# EAGLE board untitled (EAGLE 6.4), part 1 of 2
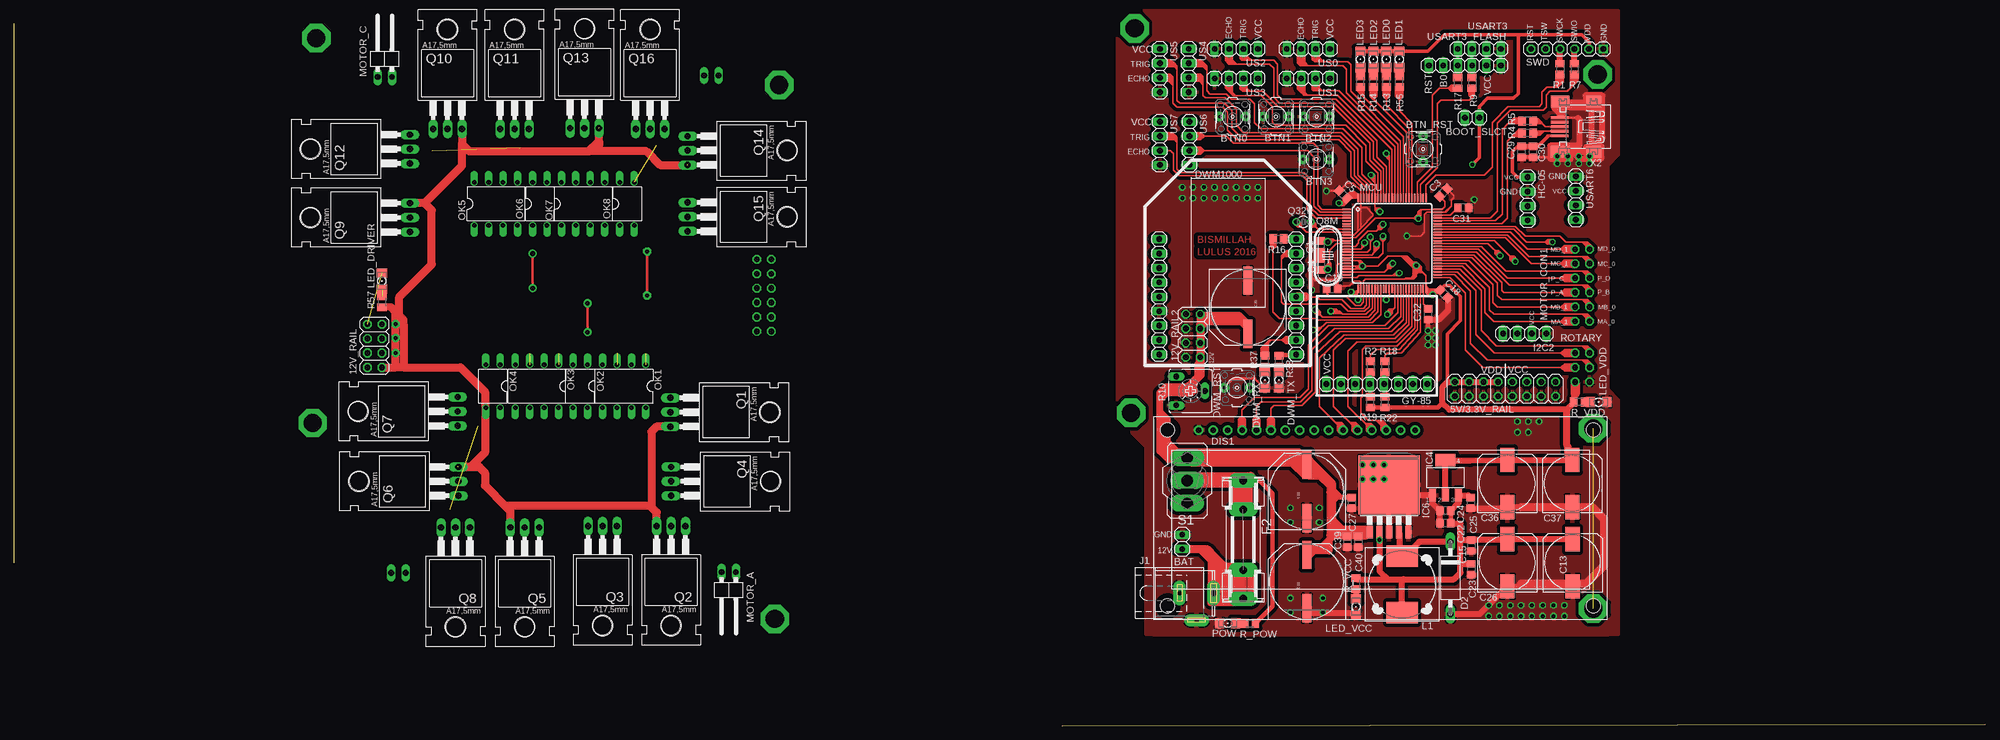
[diagram p5: board, top side]
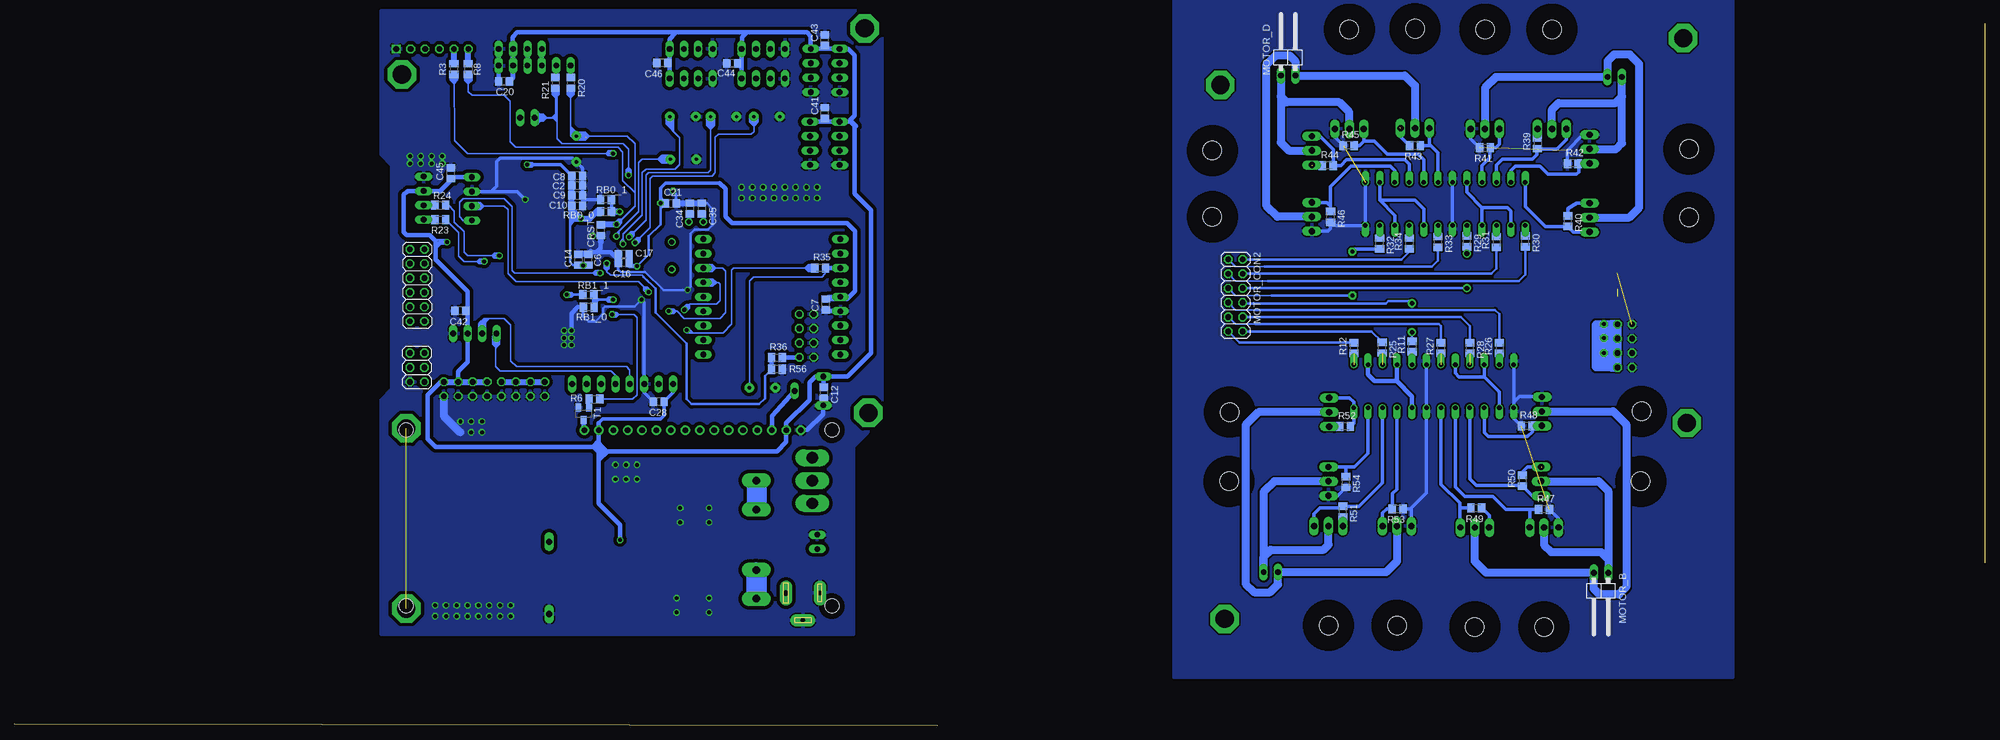
[diagram p6: board, bottom side, seen from below]

Size 347.2 x 123.7 mm. Coordinates in mm from the lower left corner, seen from the top.
Outline: 184.53,0 347.2,0.25
Outline: 0,28.7 0,123.7
Copper layers (1*16): Top 0.035mm / dielectric 1.5mm / Bottom 0.035mm
Design rules "default": minimum track width 10mil, minimum drill 24mil, track to track 8mil, track to pad 8mil, pad to pad 8mil, via to via 8mil, smd to smd 8mil, copper to edge 40mil, drill to drill 8mil, minimum pad ring 10mil, minimum via ring 8mil, stop-mask expansion 4mil, vias tented up to drill 0mil, thermal gap 10mil

## Footprints (pad centres in the part's own frame; a part is rotated, then mirrored left to right if it is on the bottom)
2X08 = drill 1.016 octagon: 1 -8.89,-1.27; 2 -8.89,1.27; 3 -6.35,-1.27; 4 -6.35,1.27; 5 -3.81,-1.27; 6 -3.81,1.27; 7 -1.27,-1.27; 8 -1.27,1.27; 9 1.27,-1.27; 10 1.27,1.27; 11 3.81,-1.27; 12 3.81,1.27; 13 6.35,-1.27; 14 6.35,1.27; 15 8.89,-1.27; 16 8.89,1.27
2X04 = drill 1.016 octagon: 1 -3.81,-1.27; 2 -3.81,1.27; 3 -1.27,-1.27; 4 -1.27,1.27; 5 1.27,-1.27; 6 1.27,1.27; 7 3.81,-1.27; 8 3.81,1.27
1X02 = drill 1.016 long: 1 -1.27,0; 2 1.27,0
PUSHBUTTON = drill 0.6 pad 1.676: 1 0,2.286; 2 0,-2.286
C0805 = smd 1.3 x 1.5: 1 -0.95,0; 2 0.95,0
PANASONIC_H13 = smd 5 x 1.6: + 4.7,0; - -4.7,0
153CLV-1012 = smd 4.3 x 2.5: + 4.15,0; - -4.15,0
DO15-12 = drill 1.118 long: A 6.35,0; C -6.35,0
TUXGR_16X2_R2 = drill 1 pad 1.676: 1 -32,15.5; 2 -29.46,15.5; 3 -26.92,15.5; 4 -24.38,15.5; 5 -21.84,15.5; 6 -19.3,15.5; 7 -16.76,15.5; 8 -14.22,15.5; 9 -11.68,15.5; 10 -9.14,15.5; 11 -6.6,15.5; 12 -4.06,15.5; 13 -1.52,15.5; 14 1.02,15.5; 15 3.56,15.5; 16 6.1,15.5 | hole 2.5: -37.5,-15.5; 37.5,-15.5; -37.5,15.5; 37.5,15.5
1206 = smd 1.6 x 1.803: A -1.422,0; C 1.422,0
SHK20L = drill 1.321 pad 2.54 long: 1A -10.414,0; 1B -5.334,0; 2A 10.414,0; 2B 5.334,0
1X08 = drill 1.016 long: 1 -8.89,0; 2 -6.35,0; 3 -3.81,0; 4 -1.27,0; 5 1.27,0; 6 3.81,0; 7 6.35,0; 8 8.89,0
1X04 = drill 1.016 long: 1 -3.81,0; 2 -1.27,0; 3 1.27,0; 4 3.81,0
SOT223 = smd 1.219 x 2.235: 1 -2.311,-3.099; 2 0,-3.099; 3 2.311,-3.099 | smd 3.6 x 2.2: 4 0,3.099
TO263-5 = smd 1.067 x 2.159: 1 -3.404,-5.791; 2 -1.702,-5.791; 3 0,-5.791; 4 1.702,-5.791; 5 3.404,-5.791 | smd 10.8 x 10.41: 6 0,2.54
SPC4078 = drill 0.8 pad 2.184 long: 1 -3,0; 2 0,-4.8 | drill 1 pad 2.184 long: 3 3,0
DR127 = smd 3.85 x 5.5: 1 -4.975,0; 2 4.975,0
LQFP100 = smd 1.5 x 0.26: 1 -8,6; 2 -8,5.5; 3 -8,5; 4 -8,4.5; 5 -8,4; 6 -8,3.5; 7 -8,3; 8 -8,2.5; 9 -8,2; 10 -8,1.5; 11 -8,1; 12 -8,0.5; 13 -8,0; 14 -8,-0.5; 15 -8,-1; 16 -8,-1.5; 17 -8,-2; 18 -8,-2.5; 19 -8,-3; 20 -8,-3.5; 21 -8,-4; 22 -8,-4.5; 23 -8,-5; 24 -8,-5.5; 25 -8,-6; 51 8,-6; 52 8,-5.5; 53 8,-5; 54 8,-4.5; 55 8,-4; 56 8,-3.5; 57 8,-3; 58 8,-2.5; 59 8,-2; 60 8,-1.5; 61 8,-1; 62 8,-0.5; 63 8,0; 64 8,0.5; 65 8,1; 66 8,1.5; 67 8,2; 68 8,2.5; 69 8,3; 70 8,3.5; 71 8,4; 72 8,4.5; 73 8,5; 74 8,5.5; 75 8,6 | smd 0.26 x 1.5: 26 -6,-8; 27 -5.5,-8; 28 -5,-8; 29 -4.5,-8; 30 -4,-8; 31 -3.5,-8; 32 -3,-8; 33 -2.5,-8; 34 -2,-8; 35 -1.5,-8; 36 -1,-8; 37 -0.5,-8; 38 0,-8; 39 0.5,-8; 40 1,-8; 41 1.5,-8; 42 2,-8; 43 2.5,-8; 44 3,-8; 45 3.5,-8; 46 4,-8; 47 4.5,-8; 48 5,-8; 49 5.5,-8; 50 6,-8; 76 6,8; 77 5.5,8; 78 5,8; 79 4.5,8; 80 4,8; 81 3.5,8; 82 3,8; 83 2.5,8; 84 2,8; 85 1.5,8; 86 1,8; 87 0.5,8; 88 0,8; 89 -0.5,8; 90 -1,8; 91 -1.5,8; 92 -2,8; 93 -2.5,8; 94 -3,8; 95 -3.5,8; 96 -4,8; 97 -4.5,8; 98 -5,8; 99 -5.5,8; 100 -6,8
1X02/90 = drill 1.016 long: 1 -1.27,-3.81; 2 1.27,-3.81
2X06 = drill 1.016 octagon: 1 -6.35,-1.27; 2 -6.35,1.27; 3 -3.81,-1.27; 4 -3.81,1.27; 5 -1.27,-1.27; 6 -1.27,1.27; 7 1.27,-1.27; 8 1.27,1.27; 9 3.81,-1.27; 10 3.81,1.27; 11 6.35,-1.27; 12 6.35,1.27
DIL08 = drill 0.813 offset: 1 -3.81,-3.81; 2 -1.27,-3.81; 3 1.27,-3.81; 4 3.81,-3.81; 5 3.81,3.81; 6 1.27,3.81; 7 -1.27,3.81; 8 -3.81,3.81
DIL04 = drill 0.813 offset: 1 -1.27,-3.81; 2 1.27,-3.81; 3 1.27,3.81; 4 -1.27,3.81
TO220 = drill 1.118 long: 1 -2.54,-6.35; 2 0,-6.35; 3 2.54,-6.35 | hole 3.302: 0,11.176
HC49U-V = drill 0.813: 1 -2.413,0; 2 2.413,0
TC26V = drill 0.813: 1 -1.27,0; 2 1.27,0
M0805 = smd 1.3 x 1.6: 1 -0.95,0; 2 0.95,0
CA6V = drill 1.016 long: A -2.54,-2.54; E 2.54,-2.54; S 0,2.54
R0805 = smd 1.3 x 1.5: 1 -0.95,0; 2 0.95,0
2X03 = drill 1.016 octagon: 1 -2.54,-1.27; 2 -2.54,1.27; 3 0,-1.27; 4 0,1.27; 5 2.54,-1.27; 6 2.54,1.27
320-916 = drill 2.007 long: 1 0,4.013; 2 0,0; 3 0,-4.013
1X06-S = drill 1.016 square: 1 -6.35,0 | drill 1.016 octagon: 2 -3.81,0; 3 -1.27,0; 4 1.27,0; 5 3.81,0; 6 6.35,0
SOT23-BEC = smd 1 x 1.4: B -0.95,-1.1; C 0,1.1; E 0.95,-1.1
MY_DWM1000_PAD_ONLY = drill 1.016 long: 1 -0.635,-12.065; 2 1.905,-12.065; 3 4.445,-12.065; 4 6.985,-12.065; 5 9.525,-12.065; 6 12.065,-12.065; 7 14.605,-12.065; 8 17.145,-12.065; 9 19.685,-12.065; 10 19.685,12.065; 11 17.145,12.065; 12 14.605,12.065; 13 12.065,12.065; 14 9.525,12.065; 15 6.985,12.065; 16 4.445,12.065; 17 1.905,12.065; 18 -0.635,12.065
1X06 = drill 1.016 long: 1 -6.35,0; 2 -3.81,0; 3 -1.27,0; 4 1.27,0; 5 3.81,0; 6 6.35,0
32005-400 = smd 3.1 x 0.5: 1 3,1.6; 2 3,0.8; 3 3,0; 4 3,-0.8; 5 3,-1.6 | smd 2.5 x 2: M1 -3,-4.45; M2 -3,4.45 | smd 3.3 x 2: M3 2.9,4.45; M4 2.9,-4.45

## Placement (x,y rotation side)
5V/3.3V_RAIL  [2X08]  262.64,59.31 180 top
12V_RAIL  [2X04]  63.5,66.93 90 top
12V_RAIL2  [2X04]  207.64,68.71 90 top
BAT  [1X02]  205.74,32.38 270 top
BOOT_SLCT  [1X02]  256.79,107.12 0 top
BTN0  PUSHBTN  [PUSHBUTTON]  214.63,107.31 270 top
BTN1  PUSHBTN  [PUSHBUTTON]  222.25,107.31 270 top
BTN2  PUSHBTN  [PUSHBUTTON]  229.43,107.31 270 top
BTN3  PUSHBTN  [PUSHBUTTON]  229.36,99.82 270 top
BTN_RST  PUSHBTN  [PUSHBUTTON]  248.16,101.6 0 top
C1  [C0805]  230.12,84.45 90 top
C2  [C0805]  248.03,95.19 0 bottom
C3  [C0805]  251.75,93.94 45 top
C4  [C0805]  230.12,81.28 270 top
C5  [C0805]  234.06,93.6 315 top
C6  [C0805]  247.84,82.11 270 bottom
C7  [C0805]  204.22,74.23 90 bottom
C8  [C0805]  248.03,96.9 180 bottom
C9  [C0805]  248.03,93.47 0 bottom
C10  [C0805]  248.03,91.63 0 bottom
C11  [PANASONIC_H13]  227.71,25.4 90 top
C12  [C0805]  204.6,58.67 270 bottom
C13  [153CLV-1012]  274.51,28.7 90 top
C14  [C0805]  246.06,82.11 90 bottom
C15  [C0805]  256.67,31.75 270 top
C16  [C0805]  239.84,81.53 180 bottom
C17  [C0805]  239.84,83.06 180 bottom
C18  [C0805]  251.83,76.11 315 top
C19  [C0805]  232.14,76.99 0 top
C20  10u  [C0805]  260.92,113.54 180 bottom
C21  [C0805]  231.52,92.08 0 bottom
C22  [C0805]  252.09,35.69 180 top
C23  [C0805]  256.67,27.56 270 top
C24  [C0805]  252.09,37.85 180 top
C25  [C0805]  256.54,39.24 270 top
C26  100u  [153CLV-1012]  263.02,28.7 90 top
C27  [C0805]  235.59,39.24 270 top
C28  [C0805]  233.68,57.09 180 bottom
C29  [C0805]  265.56,101.09 90 top
C30  [C0805]  267.59,101.09 90 top
C31  [C0805]  255.25,91.25 180 top
C32  [C0805]  249.05,72.52 90 top
C33  [PANASONIC_H13]  227.71,41.28 90 top
C34  [C0805]  228.22,91.12 270 bottom
C35  [C0805]  226.06,91.12 270 bottom
C36  100u  [153CLV-1012]  263.02,42.67 90 top
C37  100u  [153CLV-1012]  274.45,42.67 90 top
C38  [PANASONIC_H13]  217.3,73.72 270 top
C39  [C0805]  234.82,32.38 270 top
C40  [C0805]  236.73,32.38 270 top
C41  [C0805]  204.41,107.95 90 bottom
C42  [C0805]  268.61,73.09 180 bottom
C43  [C0805]  204.41,120.78 90 bottom
C44  [C0805]  220.73,116.65 180 bottom
C45  [C0805]  270.32,97.35 90 bottom
C46  [C0805]  233.04,116.78 180 bottom
CRST  [C0805]  243.9,87.31 90 bottom
D2  1N5822  [DO15-12]  252.98,26.04 270 top
DIS1  TUXGR_16X2_R2  [TUXGR_16X2_R2]  240.66,36.58 0 top
DWM_RST  PUSHBTN  [PUSHBUTTON]  215.39,59.56 270 top
DWM_RX  [1206]  220.28,60.9 270 top
DWM_TX  [1206]  222.76,60.9 270 top
F2  [SHK20L]  216.47,32.77 270 top
GY-85  [1X08]  240.03,60.2 0 top
HC-05  [1X04]  266.57,92.84 270 top
I2C2  [1X04]  266.06,69.09 180 top
IC4  LD1117 3.3V  [SOT223]  252.09,43.69 0 top
IC6  LM2576  [TO263-5]  242.19,39.88 0 top
J1  [SPC4078]  208.28,23.37 0 top
L1  100mH  [DR127]  244.47,24.89 270 top
LED0  [1206]  243.97,117.41 270 top
LED1  [1206]  241.68,117.41 270 top
LED2  [1206]  239.39,117.41 270 top
LED3  [1206]  237.11,117.41 270 top
LED_DRIVER  [1206]  64.77,78.36 90 top
LED_VCC  [1206]  236.35,20.96 270 top
LED_VDD  [1206]  279.08,57.02 0 top
MCU  STM32F407VX  [LQFP100]  242.7,84.96 0 top
MOTOR_A  [1X02/90]  125.86,23.24 180 top
MOTOR_B  [1X02/90]  67.69,23.11 180 bottom
MOTOR_C  [1X02/90]  65.28,118.11 0 top
MOTOR_CON1  [2X06]  276.23,77.6 270 bottom
MOTOR_CON2  [2X06]  132.08,75.82 270 bottom
MOTOR_D  [1X02/90]  122.81,118.37 0 bottom
OK1  PC827  [DIL08]  107.44,59.82 180 top
OK2  PC817  [DIL04]  99.69,59.82 180 top
OK3  PC827  [DIL08]  92.08,59.82 180 top
OK4  PC817  [DIL04]  84.33,59.82 180 top
OK5  PC827  [DIL08]  84.84,91.95 0 top
OK6  PC817  [DIL04]  92.58,91.95 0 top
OK7  PC827  [DIL08]  100.2,91.95 0 top
OK8  PC817  [DIL04]  107.95,91.95 0 top
POW  [1206]  213.74,18.03 180 top
Q1  IRF9530  [TO220]  121.92,55.25 270 top
Q2  IRF9530  [TO220]  115.7,28.83 180 top
Q3  IRF540  [TO220]  103.63,28.83 180 top
Q4  IRF540  [TO220]  122.05,43.05 270 top
Q5  IRF9530  [TO220]  89.92,28.58 180 top
Q6  IRF9530  [TO220]  71.88,43.05 90 top
Q7  IRF540  [TO220]  71.75,55.37 90 top
Q8  IRF540  [TO220]  77.72,28.58 180 top
Q8M  [HC49U-V]  231.39,82.8 270 top
Q9  IRF9530  [TO220]  63.37,89.53 90 top
Q10  IRF9530  [TO220]  76.33,111.51 0 top
Q11  IRF540  [TO220]  88.14,111.51 0 top
Q12  IRF540  [TO220]  63.37,101.61 90 top
Q13  IRF9530  [TO220]  100.46,111.64 0 top
Q14  IRF9530  [TO220]  124.97,101.35 270 top
Q15  IRF540  [TO220]  124.97,89.66 270 top
Q16  IRF540  [TO220]  112.01,111.51 0 top
Q32K  [TC26V]  227.08,88.77 180 top
R1  [M0805]  272.29,115.7 90 top
R2  [M0805]  238.89,63.25 90 top
R3  [M0805]  269.75,115.7 90 bottom
R4  [M0805]  266.57,104.39 0 top
R5  [M0805]  266.57,106.55 0 top
R6  [M0805]  244.98,57.53 180 bottom
R7  [M0805]  274.83,115.7 90 top
R8  [M0805]  267.21,115.7 90 bottom
R9  [M0805]  256.79,113.28 90 top
R10  [CA6V]  207.2,58.99 270 top
R11  [M0805]  100.97,66.8 90 bottom
R12  [M0805]  111.25,66.55 90 bottom
R13  [M0805]  241.68,113.47 270 top
R14  [M0805]  239.39,113.47 270 top
R15  [M0805]  237.11,113.47 270 top
R16  [M0805]  222.69,85.79 180 top
R17  [M0805]  254.25,113.28 90 top
R18  [M0805]  241.43,63.25 90 top
R19  [M0805]  238.89,57.02 270 top
R20  [R0805]  249.17,113.28 270 bottom
R21  [R0805]  251.84,113.28 270 bottom
R22  [M0805]  241.43,57.02 270 top
R23  [M0805]  272.16,89.15 180 bottom
R24  [M0805]  272.16,91.69 180 bottom
R25  [M0805]  106.24,66.61 270 bottom
R26  [M0805]  85.6,66.55 90 bottom
R27  [M0805]  95.88,66.55 90 bottom
R28  [M0805]  90.8,66.55 270 bottom
R29  [M0805]  91.31,85.35 270 bottom
R30  [M0805]  81.03,85.35 270 bottom
R31  [M0805]  86.11,85.22 90 bottom
R32  [M0805]  106.68,84.97 270 bottom
R33  [M0805]  96.39,85.22 270 bottom
R34  [M0805]  101.47,84.97 90 bottom
R35  [M0805]  205.23,80.64 0 bottom
R36  [M0805]  212.85,62.8 0 bottom
R37  [M0805]  220.28,64.2 270 top
R38  [M0805]  222.76,64.2 270 top
R39  [M0805]  78.87,102.62 90 bottom
R40  [M0805]  73.53,88.91 270 bottom
R41  [M0805]  88.14,101.86 180 bottom
R42  [M0805]  72.64,99.06 0 bottom
R43  [M0805]  100.46,102.24 180 bottom
R44  [M0805]  115.82,98.68 0 bottom
R45  [M0805]  112.14,102.24 0 bottom
R46  [M0805]  115.32,89.66 270 bottom
R47  [M0805]  77.72,38.1 0 bottom
R48  [M0805]  80.77,52.83 0 bottom
R49  [M0805]  89.66,38.35 180 bottom
R50  [M0805]  81.53,43.18 90 bottom
R51  [M0805]  113.16,37.72 270 bottom
R52  [M0805]  112.78,52.7 0 bottom
R53  [M0805]  103.5,38.23 180 bottom
R54  [M0805]  112.65,42.93 270 bottom
R55  [M0805]  243.97,113.47 270 top
R56  [M0805]  212.85,64.9 180 bottom
R57  [M0805]  64.77,74.68 90 top
R_POW  [M0805]  217.68,18.03 180 top
R_VCC  [M0805]  236.35,25.02 90 top
R_VDD  [M0805]  275.65,57.02 0 top
RB0_0  [M0805]  242.95,90.55 180 bottom
RB0_1  [M0805]  242.95,92.71 0 bottom
RB1_0  [M0805]  246.06,75.95 180 bottom
RB1_1  [M0805]  246,73.72 0 bottom
ROTARY  [2X03]  276.23,63.12 90 bottom
S1  [320-916]  206.63,43.18 180 top
SWD  [1X06-S]  273.56,119.25 180 top
T1  [SOT23-BEC]  246.89,54.99 180 bottom
U$3  MY_DWM1000_PAD_ONLY  [MY_DWM1000_PAD_ONLY]  213.74,85.09 270 top
US0  [1X04]  227.97,119.25 180 top
US1  [1X04]  227.97,114.05 180 top
US2  [1X04]  215.26,119.25 180 top
US3  [1X04]  215.26,114.05 180 top
US4  [1X04]  206.88,115.44 270 top
US5  [1X04]  201.8,115.44 270 top
US6  [1X04]  207.01,102.62 270 top
US7  [1X04]  201.8,102.62 270 top
USART3  [1X04]  258.06,119.25 180 top
USART3_FLASH  [1X06]  255.52,116.33 180 top
USART6  [1X04]  275.08,92.96 270 top
X2  MINI-USB_SHIELD  [32005-400]  275.21,105.54 180 top

## Tracks (layer width: path | path; a pad name or v marks a point on that pad's centre or on a via)
12V
  Top 0.813: C27.1 232.6,40.19 231.65,41.15 | 209.3,72.52 12V_RAIL2.7 12V_RAIL2.5 12V_RAIL2.3 12V_RAIL2.1 | 209.3,72.52 210.06,72.52 | 210.06,72.52 215.84,72.52 217.23,71.12 217.23,69.09 C38.+ | 206.62,47.18 S1.3 | 201.93,57.4 201.68,57.4 201.55,57.53 201.55,58.67 202.82,59.94 206.88,59.94 206.38,59.44 202.95,59.44 | 207.52,60.58 208.28,61.34 208.28,63.75 208.53,64.01 208.53,65.15 208.66,65.28 208.66,72.64 | 208.66,61.72 208.79,61.85 209.17,61.85 209.3,61.98 209.3,72.52 | 210.06,72.52 209.04,71.5 209.04,71.37
  Top 1.016: C11.+ 227.97,30.67 231.65,30.67 231.65,32.64 | 231.65,33.53 231.65,41.15 231.65,42.16 C33.+ 227.71,44.2 227.53,44.02 | 231.65,33.53 231.65,32.64 | 231.65,33.53 231.84,33.34 C39.1 C40.1 238.03,33.34 IC6.1 | 231.65,32.64 232.28,33.27 | 203.71,58.67 204.98,58.67 205.1,58.55 207.39,58.55 207.9,59.06 207.9,59.94 | 207.9,61.09 207.9,59.94 | 207.9,59.94 207.01,59.06
  Top 1.27: 206.62,47.18 203.01,47.18 201.8,48.39 201.8,57.47 203.01,58.67 203.71,58.67 205.61,58.67 206.88,59.94 207.52,60.58 208.66,61.72 208.91,61.98 12V_RAIL2.1
  Top 1.422: S1.3 226.49,47.19 C33.+
  Bottom 0.813: 12V_RAIL2.1 R56.1
AGND  (4 unrouted)
  Bottom 0.61: 101.09,38.35 98.42,41.02 OK2.3 OK2.2 | 101.09,38.35 101.22,38.23 R53.1 | Q3.3 101.09,38.35 | R47.2 75.18,36.51 Q8.3 | Q15.3 115.82,87.12 115.32,87.63 115.32,88.14 | 115.32,88.14 R46.2 | R45.1 114.55,103.7 Q16.3 | Q11.3 90.68,103.45 R41.2 | Q12.3 70.87,104.14 73.66,101.35 73.66,99.13 R42.1 | OK4.3 83.06,57.02 82.04,58.04 78.23,58.04 Q7.3 | OK4.2 OK4.3 | R48.1 83.06,54.17 OK4.3 | OK6.3 OK6.2 | OK8.3 OK8.2 115.31,88.14 115.32,88.14 | Q4.3 114.11,40.51 R54.2
  pour Bottom (isolate 0.305): 44.45,132.33 44.45,8.51 142.88,8.51 142.88,132.33
BAT_READ  (via drill 0.7 pad 1.02)
  Top 0.254: MCU.23 241.32,79.96 v242.82,81.47
  Bottom 0.254: v242.82,81.47 242.82,80.01 242.19,79.38 236.6,79.38 236.31,79.09 235.46,78.23
  Bottom 0.406: 236.31,79.09 234.25,77.03 234.25,72.77 228.79,67.31 228.79,57.59 227.84,56.64 216.03,56.64 214.98,57.69 214.98,61.62 R36.1
  Bottom 0.813: R56.2 R36.1
BOOT0  (via drill 0.7 pad 1.02)
  Top 0.254: 239.65,96.14 239.65,96.97 239.33,97.28 239.08,97.03 v239.01,97.03 239.7,96.34 MCU.94 239.7,91.39 v240.54,90.55
  Bottom 0.254: 251.84,107.76 R21.2 251.59,111.57 251.59,106.43 | 251.59,106.43 251.59,103.44 250.7,102.55 239.97,102.55 239.01,101.6 v239.01,97.03 | v240.54,90.55 RB0_0.1 | 255.27,107.06 252.22,107.06 251.59,106.43
  Bottom 0.305: 251.84,107.76 252.48,107.12 BOOT_SLCT.1
  Bottom 0.406: 255.27,107.51 255.27,107.06 255.27,106.17 255.21,106.11 255.21,108.01 255.14,108.08 255.14,106.87 254.95,106.68
  Bottom 0.61: RB0_0.1 RB0_1.2
BOOT1  (via drill 0.7 pad 1.02)
  Top 0.254: MCU.37 242.2,75.57 v241.68,75.06 241.68,75.5 241.94,75.5 242.19,75.76
  Bottom 0.254: v241.68,75.06 242.7,75.06 244.22,75.06 RB1_0.1
  Bottom 0.406: 242.7,75.06 244.16,75.06 244.86,74.36 244.86,74.8 244.6,75.06
  Bottom 0.813: RB1_1.2 245.05,75.88 RB1_0.1
BTN0  (via drill 0.7 pad 1.02)
  Top 0.254: MCU.15 237.25,83.96 237.43,84.14 | 237.43,84.14 237.87,84.58 | 237.87,84.58 v237.87,85.09 | 237.87,85.15 238.32,85.15 238.32,85.03 237.87,84.58 | 237.43,85.15 237.43,84.14
  Bottom 0.254: 216.92,105.66 216.92,104.71 217.36,104.27 223.14,104.27 223.71,103.69 223.71,97.41 224.28,96.84 234.76,96.84 235.2,96.39 235.2,87.76 v237.87,85.09 | 216.92,105.66 BTN0.1 | 217.68,107.31 217.68,106.43 216.92,105.66 | 216.92,105.66 216.15,106.43 216.15,107.31 216.79,107.31
  Bottom 0.305: BTN0.1 217.68,107.31
BTN1  (via drill 0.7 pad 1.02)
  Top 0.254: MCU.16 238.34,83.46 238.89,84.01 238.89,85.28 | 238.89,85.28 238.89,85.47 | 238.89,85.47 v238.89,86.11 | 238.82,86.11 238.44,86.11 238.44,85.91 238.89,85.47 | 238.89,85.28 239.33,85.72 239.33,86.17
  Bottom 0.254: BTN1.1 224.54,97.92 224.98,97.47 235.46,97.47 235.9,97.03 235.9,89.09 236.79,88.2 237.36,87.63 v238.89,86.11 238.89,86.17
BTN2  (via drill 0.7 pad 1.02)
  Top 0.254: 238.16,82.96 MCU.17 239.11,82.96 239.52,83.38 | 239.52,83.38 239.97,83.82 | 239.97,83.82 v239.97,84.9 | 239.97,84.96 239.52,84.96 239.52,83.38 | 239.97,83.82 240.35,84.2 240.35,84.96 240.28,84.9 239.78,84.9 239.71,84.84 239.71,83.76 240.16,84.2 240.16,84.71
  Bottom 0.254: 231.01,104.65 230,103.63 230,98.87 230.76,98.11 235.9,98.11 236.6,97.41 236.6,89.98 239.97,86.61 239.97,85.79 | 231.01,104.65 231.71,105.35 | 231.71,105.35 BTN2.1 231.71,107.51 232.41,107.51 232.41,106.05 231.71,105.35 | 239.97,85.79 v239.97,84.9 240.41,84.9 240.41,85.34 239.97,85.79 | 239.71,84.9 239.84,85.03 | 239.84,85.03 240.16,85.34 240.16,85.47 240.22,85.41 240.22,85.03 | 231.71,105.35 231.01,106.05 | 231.01,106.05 231.01,106.24 | 231.01,106.24 231.01,107.51 231.52,107.51 231.52,105.73 231.27,105.98 231.27,107.38 | 231.2,106.24 231.01,106.24 | 231.01,106.05 231.01,104.65 | 239.97,85.79 239.84,85.66 239.84,85.03
BTN3  (via drill 0.7 pad 1.02)
  Top 0.254: MCU.18 240.32,82.46 241.11,83.25 241.11,85.28 | 241.11,85.28 v241.11,86.23 | v241.11,86.23 241.3,86.23 241.55,86.23 241.55,85.72 241.11,85.28 | 241.11,85.28 240.66,85.72 240.66,86.23 v241.11,86.23
  Bottom 0.254: 233.81,99.82 236.6,99.82 237.24,99.19 237.24,90.61 240.66,87.19 | 233.81,99.82 BTN3.1 231.65,100.52 233.11,100.52 233.81,99.82 | 241.11,86.61 v241.11,86.23 241.11,86.74 240.66,87.19 | 241.11,86.17 240.73,86.17 240.66,86.23 240.66,87.19 | 233.81,99.82 233.11,99.12 231.65,99.12 231.65,99.63 233.43,99.63 233.17,99.38 231.78,99.38
BTN4
  Bottom 0.254: 224.54,105.09 224.54,107.25 225.23,107.25 225.23,105.79 224.54,105.09 | 224.54,105.09 223.84,105.79 223.84,107.25 224.35,107.25 224.35,105.47 224.09,105.73 224.09,107.12
BTN5
  Bottom 0.254: 245.94,103.89 248.09,103.89 248.09,103.19 246.63,103.19 245.94,103.89 | 245.94,103.89 246.63,104.58 248.09,104.58 248.09,104.08 246.32,104.08 246.57,104.33 247.97,104.33
D+
  Top 0.305: X2.3 269.75,105.54 268.73,106.55 R5.2
D-
  Top 0.305: X2.2 267.87,104.74 R4.2
DWM_IRQ
  Top 0.254: MCU.33 240.2,72.94 238.76,71.5 229.55,71.5 229.3,71.75 222.88,71.75 221.74,72.9 R16.2
DWM_RST
  Bottom 0.254: DWM_RST.1 217.68,78.36 216.98,79.06 204.91,79.06 204.34,79.63 204.34,80.58 R35.2
  Bottom 0.813: U$3.3 R35.2
DWM_RSTN  (via drill 0.7 pad 1.02)
  Top 0.254: MCU.34 240.7,72.42 239.27,70.99 231.14,70.99 229.74,69.72 v228.73,69.72 228.73,70.17 230.25,70.17 229.43,69.34 228.6,69.34 228.6,69.53 229.43,69.53 229.81,69.91 229.81,69.98 228.85,69.98
  Bottom 0.254: 228.22,69.22 v228.73,69.72 228.73,69.79 228.47,70.04 227.65,69.22 | 228.22,69.22 227.65,69.22 | 227.65,69.22 222.38,69.22 220.85,70.74 220.85,80.26 220.47,80.64 R35.1 | 228.22,69.22 228.79,69.22 229.04,69.47 228.85,69.47 228.54,69.79 228.47,69.79 228.03,69.34 228.73,69.34 228.79,69.41
EN_A0
  Bottom 0.406: MOTOR_CON2.11 131.38,67.5 R12.2
EN_A1
  Bottom 0.406: MOTOR_CON2.12 108.14,69.47 R25.1
EN_B0
  Bottom 0.305: MOTOR_CON2.9 132.08,70.74 128.52,70.74
  Bottom 0.406: 128.52,70.74 96.2,70.74 95.88,70.42 R27.2
EN_B1
  Bottom 0.406: MOTOR_CON2.10 92.39,72.01 90.8,70.42 R28.1
EN_C0
  Bottom 0.305: MOTOR_CON2.3 132.08,78.36 126.36,78.36
  Bottom 0.406: 126.36,78.36 82.17,78.36 81.03,79.5 R30.2
EN_C1
  Bottom 0.406: MOTOR_CON2.4 87,79.63 86.11,80.52 R31.1
EN_D0
  Bottom 0.305: MOTOR_CON2.1 132.08,80.9 127,80.9
  Bottom 0.406: 127,80.9 97.47,80.9 96.39,81.98 R33.2
EN_D1
  Bottom 0.406: MOTOR_CON2.2 102.87,82.17 101.47,83.57 R34.1
GND  (via drill 0.7 pad 1.02)
  Top 0.254: C5.1 234.75,95.63 235.84,95.63 237.2,94.27 MCU.99 237.2,87.72 | MCU.20 233.35,81.46 232.92,81.03 232.92,78.74 | v245.3,86.3 247.78,86.3 248.41,86.93 248.41,90.04 248.83,90.46 MCU.74 252.01,90.46 | MCU.10 235.94,86.46 237.2,87.72 | C19.2 233.57,77.47 235.2,77.47 236.09,78.36 236.98,78.36 237.2,78.14 MCU.27 237.2,75.53 v236.73,75.06 | 250,90.49 252.09,90.49 | 252.09,90.49 252.16,90.49 252.6,90.93 | 236.73,87.31 236.73,90.8 237.17,91.25 238.25,91.25 239.33,90.17 239.33,89.85 237.2,87.72 | 252.01,90.46 253.11,91.57 253.11,92.58 253.62,93.09 253.62,93.42 C3.2 | 252.01,90.46 252.07,90.46 252.09,90.49
  Top 0.406: C4.1 229.11,82.23 228.6,81.72 228.6,79.06 | 228.6,79.06 229.11,78.55 232.73,78.55 | 232.73,78.55 232.92,78.74 | C5.1 231.18,94.27 v231.14,94.23 | 277.75,101.09 278.07,101.09 278.07,109.98 272.22,109.98 272.21,109.97 X2.5 272.22,107.12 275.46,107.12 | 272.86,101.09 272.35,101.09 271.4,100.14 C30.1 | 228.6,79.06 v228.6,76.77 | 232.73,78.55 233.09,78.19 C19.2 | 220.18,59.47 218.44,61.21 214.76,61.21 DWM_RST.2
  Top 0.61: v257.18,92.71 257.18,92.22
  Top 0.813: IC6.5 245.59,39.01 243.33,41.28 242.19,40.13 IC6.3 | C1.1 C4.1 | C29.1 C30.1 | C32.1 v249.05,69.6
  Top 1.016: IC6.6 243.33,41.28 244.02,40.59 IC4.1 249.78,39.21 C24.2 C22.2 | C25.2 262.79,38.29 C36.- 265.43,38.52 C37.- | C13.- C26.- 258.15,19.69 D2.A | LED_VCC.C 236.07,19.81 227.97,19.81 227.71,20.07 C11.- | C32.1 250.95,71.57 252.6,73.22 252.6,75.33 C18.2 | 272.48,109.86 277.75,109.86 277.81,109.92 277.81,101.16 277.75,101.09 272.86,101.09 | 272.22,107.51 272.35,107.51 | 272.35,107.51 272.92,107.51 272.92,109.22 | 275.46,107.12 275.65,106.93 275.65,102.23 275.59,102.17 270.57,102.17 270.57,99.95 270.64,99.88 274.13,99.88 274.07,99.95 274.07,101.6 275.72,99.95 279.53,99.95 279.59,100.01 279.59,102.11 279.46,101.98 276.92,101.98 276.86,101.92 276.86,100.65 279.78,103.57 279.78,111 279.72,111.06 276.8,111.06 276.8,108.9 276.86,108.84 279.21,108.84 279.15,108.9 271.21,108.9 272.35,107.76 272.35,107.51
  Top 1.422: 265.43,38.52 277.96,38.52 280.03,36.45 280.03,28.19 276.86,25.02 265.43,25.02
  Bottom 0.254: v245.3,86.3 243.97,86.3 CRST.1
  Bottom 0.406: v231.14,94.23 230.57,93.66 C21.2 | C35.1 225.17,92.07 224.16,91.06 224.16,88.2 224.98,87.38 227.39,87.38 228.03,86.74 228.03,77.34 v228.6,76.77 232.85,76.77 236.03,79.95 240.28,79.95 240.79,80.45 C16.2 | RB1_1.1 246.95,72.13 246.06,71.25 244.79,71.25 243.46,72.58 243.46,73.47 243.08,73.85 237.94,73.85 v236.73,75.06
  Bottom 0.61: C28.2 236.22,58.68 GY-85.3 236.22,74.55 v236.73,75.06 | 247.08,92.71 C9.2 C2.2 C8.1 247.08,98.24 BTN_RST.2 248.86,100.01 261.62,100.01 262.25,99.38 262.25,95.06 263.21,94.11 HC-05.2 258.57,94.11 v257.18,92.71 | 247.08,92.71 C10.2 | RB0_1.1 247.08,92.71
  Bottom 0.813: C12.2 R10.E 204.72,56.39 204.72,54.86 207.51,52.08 DIS1.1 | USART3.1 USART3_FLASH.1 C20.2 | 241.18,82.49 242.16,83.47 244.6,83.47 | 244.6,83.47 245.65,83.47 | 243.9,85.22 243.9,84.17 244.6,83.47 | C7.1 203.96,73.03 U$3.6 | v249.05,69.6 249.05,72.64 247.97,73.72 RB1_1.1
  Bottom 1.016: C21.2 C34.1 C35.1 | CRST.1 243.9,85.22 | 245.65,83.47 C14.2 C6.1 | 241.18,82.49 C17.2 C16.2
  Bottom 1.422: 5V/3.3V_RAIL.2 271.53,54.61 268.61,51.69
  other vias: 261.62,19.3 263.52,19.3 265.43,19.3 267.33,19.3 269.24,19.3 271.14,19.3 273.05,19.3 259.72,19.3 259.72,21.21 261.62,21.21 263.52,21.21 265.43,21.21 267.33,21.21 269.24,21.21 271.14,21.21 273.05,21.21 237.49,45.97 239.39,45.97 241.3,45.97 237.49,43.43 239.39,43.43 241.3,43.43 224.79,38.35 224.79,35.81 229.87,38.35 229.87,35.81 230.5,22.48 230.5,19.94 224.79,22.48 224.79,19.94 266.7,51.69 264.8,51.69 264.8,53.59 266.7,53.59 268.61,53.59 205.74,94.87 207.64,94.87 209.55,94.87 211.45,94.87 213.36,94.87 215.26,94.87 217.17,94.87 219.07,94.87 219.07,92.96 217.17,92.96 215.26,92.96 213.36,92.96 211.45,92.96 209.55,92.96 207.64,92.96 205.74,92.96 271.78,100.33 273.69,100.33 275.59,100.33 277.5,100.33 277.5,99.06 275.59,99.06 275.59,99.06 273.69,99.06 271.78,99.06 249.05,68.33 249.05,67.06 250.32,69.6 250.32,68.33 250.32,67.06
  pour Top (isolate 0.61): 200.66,54.36 280.8,54.36 280.8,16.13 200.66,16.13
  pour Bottom (isolate 0.61): 194.31,125.98 282.57,125.98 282.57,100.58 280.67,98.68 280.67,59.31 282.57,57.4 282.57,16.13 199.39,16.13 199.39,49.15 194.31,54.23
  pour Top (isolate 0.61): 194.31,125.98 282.57,125.98 282.57,100.58 280.67,98.68 280.67,59.31 282.57,57.4 282.57,16.13 199.39,16.13 199.39,49.15 194.31,54.23
HOL  (via drill 3.2 pad 5)  (1 unrouted)
  other vias: 278.13,20.64 278.13,52.39
I2C2_SCL
  Top 0.254: GY-85.4 238.76,58.1 R19.1
  Top 0.61: R2.1 238.76,62.17 GY-85.4
  Bottom 0.254: GY-85.4 238.76,62.67 239.33,63.25 258.7,63.25 259.72,64.26 259.72,70.61 260.86,71.75 263.52,71.75 | 263.52,71.75 264.22,71.75 | 264.22,71.75 264.92,71.06 264.92,69.22 I2C2.3 | 264.8,68.96 264.16,68.96 264.16,71.12 263.52,71.75 | 264.22,71.75 264.41,71.75 264.54,71.63 | 265.18,70.99 265.43,70.74 265.43,68.96 265.18,68.96 265.18,70.99 | 265.18,70.99 264.54,71.63 | 264.54,71.63 263.91,71.63 264.41,71.12 264.41,69.09 264.67,69.09 264.67,70.99 264.29,71.37 264.29,71.5
I2C2_SDA
  Top 0.254: GY-85.5 241.3,58.1 R22.1
  Top 0.61: R18.1 241.3,62.17 GY-85.5
  Bottom 0.254: GY-85.5 241.3,61.72 242.06,62.48 261.62,62.48 262.38,63.25 262.38,68.96 I2C2.4
LCD_BL  (via drill 0.7 pad 1.02)
  Top 0.254: MCU.39 243.2,73.65 v241.87,72.45 241.43,72.45
  Bottom 0.254: R6.1 238.25,57.53 237.49,58.29 237.49,71.95 238,72.45 v241.87,72.45
LCD_D1
  Top 0.254: 236.6,52.08 232.41,56.27
LCD_D4
  Top 0.254: MCU.43 245.2,71.08 242.95,68.83 234.19,68.83 229.87,64.77 229.87,56.27 DIS1.11
LCD_D5
  Top 0.254: MCU.44 245.7,70.69 243.2,68.2 234.44,68.2 232.41,66.17 232.41,56.27 DIS1.12
LCD_D6
  Top 0.254: MCU.45 246.2,70.3 243.46,67.56 236.47,67.56 234.95,66.04 234.95,56.27 DIS1.13
LCD_D7
  Top 0.254: MCU.46 246.7,70.04 243.59,66.93 238.12,66.93 237.49,66.29 237.49,58.04 237.17,57.72 237.17,55.12 238.51,53.78 239.84,53.78 239.98,53.78 | 239.98,53.78 DIS1.14 | DIS1.14 242.19,52.58 240.98,53.78 239.98,53.78
LCD_EN
  Top 0.254: MCU.42 244.7,71.6 242.57,69.47 233.55,69.47 229.24,65.53 229.24,58.8 226.82,56.39 221.87,56.39 221.37,55.88 DIS1.6
LCD_RS
  Top 0.254: MCU.40 243.7,72.75 241.43,70.48 231.52,70.48 227.97,67.06 227.97,59.31 226.5,57.85 218.5,57.85 216.28,55.63 216.28,55.62 DIS1.4
LCD_RW
  Top 0.254: DIS1.5 218.82,56.27 219.58,57.02 226.57,57.02 228.6,59.06 228.6,66.29 232.54,69.98 242.06,69.98 244.22,72.14 244.22,76.94 MCU.41
LED0
  Top 0.254: MCU.81 246.2,106.1
  Top 0.305: 244.09,112.4 R55.2 243.97,108.33 246.2,106.1
LED1
  Top 0.254: MCU.82 245.7,105.33
  Top 0.305: 245.7,105.33 241.68,109.35 R13.2
LED2
  Top 0.254: MCU.83 245.2,104.56
  Top 0.305: 245.2,104.56 239.39,110.36 R14.2
LED3
  Top 0.254: MCU.84 244.7,103.79 | 237.74,112.33 237.74,110.74
  Top 0.305: 244.7,103.79 237.74,110.74 237.11,111.38 R15.2
MA_0
  Top 0.254: MCU.56 255.59,81.46 259.84,77.22 259.84,73.28 260.6,72.52 276.23,72.52 MOTOR_CON1.11
MA_1
  Top 0.254: MCU.55 255.08,80.96 259.08,76.96 259.08,72.77 260.6,71.25 MOTOR_CON1.12
MB_0
  Top 0.254: MCU.58 256.75,82.46 261.24,77.98 261.24,75.82 262,75.06 276.23,75.06 MOTOR_CON1.9
MB_1
  Top 0.254: MCU.57 256.24,81.96 260.48,77.72 260.48,74.55 261.24,73.79 MOTOR_CON1.10
MC_0
  Top 0.254: MCU.66 263.04,86.46 266.83,82.68 276.23,82.68 MOTOR_CON1.3
MC_1
  Top 0.254: MCU.65 262.65,85.96 267.21,81.41 MOTOR_CON1.4
MD_0
  Top 0.254: MCU.69 264.46,87.96 266.19,86.23 272.29,86.23 273.3,85.22 276.23,85.22 | 276.23,85.22 276.86,84.58 | 276.86,84.58 MOTOR_CON1.1 | MOTOR_CON1.1 277.94,84.39 277.11,85.22 276.23,85.22 | MOTOR_CON1.1 277.05,83.5 | 276.86,84.58 276.86,83.69
MD_1
  Top 0.254: MCU.67 263.56,86.96 266.57,83.95 MOTOR_CON1.2
MD_2
  Top 0.254: 276.86,82.04 277.5,81.41 | 277.5,81.41 277.94,81.85 277.11,82.68 276.23,82.68 276.73,82.17 276.86,82.04 | 277.5,81.41 277.05,80.96 | 276.86,82.04 276.86,81.15
MD_3
  Top 0.254: 276.86,79.5 277.5,78.87 | 277.5,78.87 277.94,79.31 277.11,80.14 276.23,80.14 276.73,79.63 276.86,79.5 | 277.5,78.87 277.05,78.42 | 276.86,79.5 276.86,78.61
MD_4
  Top 0.254: 276.86,76.96 277.5,76.33 | 277.5,76.33 277.94,76.77 277.11,77.6 276.23,77.6 276.73,77.09 276.86,76.96 | 277.5,76.33 277.05,75.88 | 276.86,76.96 276.86,76.07
MD_5
  Top 0.254: 276.86,74.42 277.5,73.79 | 277.5,73.79 277.94,74.23 277.11,75.06 276.23,75.06 276.73,74.55 276.86,74.42 | 277.5,73.79 277.05,73.34 | 276.86,74.42 276.86,73.53
MD_6
  Top 0.254: 276.86,71.88 277.5,71.25 | 277.5,71.25 277.94,71.69 277.11,72.52 276.23,72.52 276.73,72.01 276.86,71.88 | 277.5,71.25 277.05,70.8 | 276.86,71.88 276.86,70.99
MD_7
  Top 0.254: 276.86,66.29 277.5,65.66 | 277.5,65.66 277.94,66.1 277.11,66.93 276.23,66.93 276.73,66.42 276.86,66.29 | 277.5,65.66 277.05,65.21 | 276.86,66.29 276.86,65.41
MD_8
  Top 0.254: 276.86,63.75 277.5,63.12 | 277.5,63.12 277.94,63.56 277.11,64.39 276.23,64.39 276.73,63.88 276.86,63.75 | 277.5,63.12 277.05,62.67 | 276.86,63.75 276.86,62.86
N$1  (via drill 0.7 pad 1.02)
  Top 0.254: MCU.64 260.74,85.46 v264.41,81.79
  Bottom 0.254: v264.41,81.79 267.97,81.79 268.92,82.74 268.92,86.87 R23.1
N$2
  Bottom 1.016: R3.2 SWD.5
N$3
  Top 1.016: BAT.2 208.66,31.12 210.69,29.08 210.69,22.99 211.58,22.1 215.39,22.1 215.9,21.59 210.69,21.59 210.69,24.89 210.95,25.15
  Top 1.422: BAT.2 210.06,31.12 211.33,29.84 211.33,23.42 J1.3 212.3,22.35 215.2,22.35 | F2.2A 215.2,22.35 | 215.2,27.43 215.2,22.35
N$4
  Top 0.305: MCU.73 253.01,89.96 C31.2
N$5
  Top 0.305: 231.52,81.34 231.52,80.39
N$6
  Top 1.016: R_VDD.2 LED_VDD.A
N$7
  Top 1.016: 274.7,58.48 274.7,60.45 275.15,60.45 275.21,60.39 275.21,58.42 274.76,57.97
N$8
  Bottom 0.813: R10.S 213.75,54.61 DIS1.3
N$9
  Top 0.813: LED1.C R13.1
N$10
  Top 0.813: LED2.C R14.1
N$11
  Top 0.813: LED3.C R15.1
N$12
  Bottom 0.61: OK3.7 93.34,42.04 91.69,40.39 86.74,40.39 84.45,38.1 80.39,38.1 | 80.39,38.1 R47.1 | Q8.1 80.26,37.97 80.39,38.1
N$13
  Bottom 0.813: R6.2 T1.B
N$14  (via drill 0.7 pad 1.02)
  Top 0.254: MCU.63 259.59,84.96 v261.75,82.8
  Bottom 0.254: R24.1 270.7,91.69 269.69,90.68 269.69,88.77 267.97,87.06 267.97,83.44 267.33,82.8 v261.75,82.8
N$15
  Bottom 0.813: T1.C 246.89,52.2 DIS1.16
N$16
  Bottom 1.016: R8.2 SWD.6
N$17
  Top 0.813: L1.1 244.83,29.74 244.16,30.42 | 243.97,34.01 IC6.4
  Top 1.016: D2.C 247.48,32.38 244.83,29.74 | 243.97,34.01 243.97,30.61 244.16,30.42
N$18
  Top 1.016: R7.2 SWD.3
N$19
  Top 1.422: 216.47,22.29 216.47,27.3 216.53,27.37
N$20
  Top 1.016: POW.A R_POW.2
N$21
  Top 1.016: R1.2 SWD.4
N$22
  Top 0.254: MCU.47 247.2,69.78 243.97,66.29 239.9,66.29 238.89,65.28 R2.2
N$23
  Top 0.254: MCU.49 248.2,74.32 C32.2
N$24
  Top 0.254: MCU.48 247.7,69.39 244.35,65.66 241.87,65.66 241.43,65.21 R18.2
N$25
  Bottom 0.813: USART3_FLASH.6 R20.1
N$26
  Top 0.305: MCU.78 247.7,95.3 250.7,98.3 250.7,109.6 251.33,110.24 256.29,110.24 256.79,110.74 R9.1
N$27
  Top 0.305: MCU.79 247.2,95.81 249.81,98.42 249.81,111.06 251.08,112.33 R17.1 254.25,111.82
N$28
  Top 1.422: 217.74,27.43 217.81,27.37 217.81,22.29
N$29
  Top 1.016: R_VCC.1 LED_VCC.A
N$30
  Bottom 1.422: Q3.2 103.63,28.96 105.54,27.05 MOTOR_A.2 124.59,24.89 125.98,23.5 128.78,23.5 130.3,25.02 130.3,52.96 128.02,55.25 Q1.2
N$31
  Top 1.422: 215.2,43.24 215.2,37.97
N$32
  Top 1.422: 217.3,43.24 217.36,43.18 217.36,37.72
N$33
  Bottom 1.422: Q2.2 115.7,31.88 116.59,30.99 125.86,30.99 127.13,29.72 MOTOR_A.1 127.13,41.15 125.22,43.05 Q4.2
N$34
  Bottom 0.61: R52.2 111.25,53.28 OK1.8 111.25,57.02 112.01,57.78 Q1.1
N$35
  Bottom 0.61: OK1.7 108.71,48.01 111.12,45.59 112.65,45.59 | 112.65,45.59 Q4.1 | R54.1 112.65,45.59
N$36
  Bottom 0.61: OK1.6 106.17,42.8 110.36,38.61 113.1,38.61 R51.1 113.47,38.35 117.22,38.35 118.24,37.34 Q2.1
N$37
  Bottom 0.61: OK1.5 103.63,41.66 104.39,40.89 104.39,38.29 R53.2 105.41,38.23 106.17,37.47 Q3.1
N$38
  Bottom 0.813: OK2.4 100.97,58.04 103.63,60.71 | 103.63,60.71 OK1.4 | OK1.2 108.71,61.85 107.57,60.71 103.63,60.71
N$39
  Bottom 1.422: Q5.2 89.92,28.96 87.88,26.92 MOTOR_B.2 68.96,24.13 67.94,23.11 64.52,23.11 63.25,24.38 63.25,53.09 65.53,55.37 Q7.2
N$40
  Bottom 1.422: Q8.2 77.72,31.88 76.45,30.61 67.69,30.61 66.42,29.34 MOTOR_B.1 66.42,41.4 68.07,43.05 Q6.2
N$41  (1 unrouted)
N$42  (1 unrouted)
N$43
  Bottom 0.61: OK3.8 95.88,42.55 92.58,39.24 92.58,38.48 | 92.58,38.48 92.58,35.05 Q5.1 | R49.2 92.46,38.35 92.58,38.48
N$44
  Bottom 0.61: OK2.1 R11.1
N$45  (via drill 3.2 pad 5)
  other vias: 196.72,55.12
N$46
  Bottom 0.61: Q6.1 79.82,40.51 R50.1 81.59,42.29 89.66,42.29 90.8,43.43 OK3.6
N$47
  Bottom 0.61: OK3.5 88.27,51.69 87.5,50.93 80.64,50.93 79.82,51.75 R48.2 Q7.1
N$48
  Bottom 0.61: OK4.4 85.6,58.8 88.27,61.47 | 88.27,61.47 OK3.4 | OK3.2 93.34,62.1 92.71,61.47 88.27,61.47
N$49  (1 unrouted)
N$50  (1 unrouted)
N$51
  Bottom 0.61: OK4.1 R26.1
N$52
  Bottom 1.422: Q11.2 88.14,112.39 86.23,114.3 MOTOR_C.2 66.55,117.09 65.41,118.24 62.61,118.24 60.96,116.59 60.96,91.31 62.74,89.53 Q9.2
N$53
  Bottom 1.422: Q12.2 65.02,101.61 64.01,102.62 64.01,110.87 | 64.01,110.87 MOTOR_C.1 | Q10.2 76.33,108.58 75.18,109.73 65.15,109.73 64.01,110.87
N$54
  Bottom 0.61: OK5.8 81.03,91.44 77.54,87.95 R40.2 72.57,86.99 Q9.1
N$55
  Bottom 0.61: OK5.7 83.57,97.8 82.8,98.56 78.49,98.56 77.09,97.16 72.01,97.16 71.63,97.54 71.63,99 R42.2 Q12.1
N$56
  Bottom 0.61: OK5.6 86.11,98.81 85.09,99.83 79.76,99.83 78.99,100.59 78.99,101.54 R39.1 78.8,101.61 75.44,101.61 73.79,103.26 Q10.1
N$57
  Bottom 0.61: OK5.5 88.65,98.68 87.25,100.08 87.25,101.8 R41.1 86.23,101.86 85.6,102.49 Q11.1
N$58
  Bottom 0.61: OK6.4 91.31,93.98 88.65,91.31 | 88.65,91.31 OK5.4 | OK5.2 83.57,90.68 84.2,91.31 88.65,91.31
N$59
  Bottom 0.61: OK5.1 R30.1
N$60
  Bottom 0.61: OK5.3 R31.2
N$61
  Bottom 0.61: OK6.1 R29.1
N$62
  Bottom 1.422: Q13.2 100.46,112.78 102.24,114.56 MOTOR_D.2 121.54,117.09 122.55,118.11 124.97,118.11 126.62,116.46 126.62,91.57 124.71,89.66 Q15.2
N$63
  Bottom 1.422: MOTOR_D.1 124.08,110.87 | 124.08,110.87 124.08,102.74 122.68,101.35 Q14.2 | Q16.2 112.01,108.08 113.79,109.86 123.06,109.86 124.08,110.87
N$64
  Bottom 0.61: OK7.8 96.39,100.97 97.66,102.24 98.17,102.24 | 98.17,102.24 R43.1 | Q13.1 97.92,102.49 98.17,102.24
N$65
  Bottom 0.61: OK7.7 98.93,99.7 99.95,100.72 105.28,100.72 107.57,103 109.47,103 | 109.47,103 110.24,102.24 R45.2 | Q16.1 109.47,103
N$66
  Bottom 0.61: OK7.6 101.47,98.94 102.23,99.7 112.52,99.7 113.54,98.68 R44.2 114.81,98.75 114.81,101.48 117.22,103.89 Q14.1
N$67
  Bottom 0.61: OK7.5 104.01,97.8 104.77,98.56 111.76,98.56 115.32,95 115.32,91.57 | Q15.1 115.95,92.2 115.32,91.57 | 115.32,91.57 R46.1
N$68
  Bottom 0.61: OK7.4 104.01,89.92 106.68,92.58 106.68,92.71 | 106.68,92.71 OK8.4 | OK7.2 98.93,91.06 100.46,92.58 106.55,92.58 106.68,92.71
N$69
  Bottom 0.61: OK7.1 R33.1
N$70
  Bottom 0.61: OK7.3 R34.2
N$71
  Bottom 0.61: OK8.1 R32.1
N$72
  Bottom 0.813: USART3_FLASH.5 251.71,114.36 R21.1
N$73
  Top 1.422: 216.22,42.99 216.28,42.93 216.28,38.1
N$74
  Bottom 1.422: 216.53,43.12 216.53,38.1
N$75
  Bottom 1.422: 216.53,28.13 216.53,21.84
N$76
  Bottom 1.422: 217.61,27.5 217.61,22.35
N$77
  Bottom 1.422: 215.39,27.37 215.39,22.54
N$78
  Bottom 1.422: 217.49,43.05 217.49,37.85 217.61,37.85
N$79
  Bottom 1.422: 215.39,43.12 215.39,37.97 215.2,37.97
N$80
  Bottom 0.254: 216.66,107.19 216.66,106.05 216.41,106.3 216.41,107.19 217.04,106.55 | 217.04,106.55 217.04,106.05 | 217.04,106.55 217.04,107.06 217.55,107.06 217.17,106.68 217.17,106.17 217.42,106.43 217.42,106.81
N$81
  Bottom 0.254: 242.63,100.65 241.81,100.65
N$82
  Top 0.813: LED0.C R55.1
N$83
  Top 0.254: 223.33,67.95 U$3.11 225.81,68.58 223.97,68.58 223.33,67.95 | 223.33,67.95 221.36,67.95 | 221.36,67.95 221.04,67.95 220.92,67.82 | 220.92,67.82 220.28,67.18 | 220.28,67.18 220.28,65.21 | 220.28,65.21 R37.1 | 223.33,67.95 223.97,67.31 225.74,67.31 | 220.28,65.21 219.58,65.21 219.58,66.48 220.28,67.18 | 220.92,67.82 220.92,65.28 | 220.79,67.31 220.79,67.37 221.36,67.95
N$84
  Top 0.254: U$3.10 223.01,65.41 R38.1
N$85
  Top 0.813: R37.2 DWM_RX.A
N$86
  Top 0.813: R38.2 DWM_TX.A
N$87
  Bottom 0.254: 239.2,97.98 239.2,97.16
N$88  (via drill 3.2 pad 5)
  other vias: 53.21,121.16
N$89  (via drill 3.2 pad 5)
  other vias: 278.89,114.74
N$90  (via drill 3.2 pad 5)
  other vias: 197.36,122.87
N$91
  Top 0.813: U$3.18 225.74,85.79 R16.1
N$92
  Bottom 0.254: 255.91,99.06 256.73,99.06
N$93
  Top 0.813: R_POW.1 221.62,21.02 221.62,40.89 219.33,43.18 F2.1A
  Top 1.422: F2.1A S1.2
N$94
  Bottom 0.254: 241.49,90.36 240.66,90.36
N$95
  Bottom 0.254: 242.06,88.14 241.24,88.14
N$96
  Bottom 0.254: 240.55,89.16 241.14,88.57
N$97
  Bottom 0.254: 237.31,85.92 237.9,85.33
N$98
  Bottom 0.254: 238.33,86.93 238.91,86.35
N$99
  Top 0.254: 237.04,81.34 237.04,81.28 236.22,80.45
N$100
  Bottom 0.254: 240.79,86.87 240.86,86.8 | 240.86,86.8 240.92,86.74 240.92,86.36 240.86,86.42 240.86,86.8
N$101
  Bottom 0.254: 242.63,80.52 242.63,81.34
N$102
  Bottom 0.254: 244.92,79.57 244.09,79.57
N$103
  Bottom 0.254: 262.7,82.61 261.87,82.61
N$104
  Bottom 0.254: 265.37,81.6 264.54,81.6
N$105
  Bottom 0.254: 246.38,89.53 247.21,89.53
N$106
  Bottom 0.254: 271.91,85.03 271.08,85.03
N$107
  Bottom 0.254: 272.03,85.09 272.48,84.65 272.54,84.65 272.41,84.77 272.41,85.09 272.29,85.09
N$108
  Bottom 0.254: 241.05,72.64 241.74,72.64
N$109
  Bottom 0.254: 242.63,74.87 241.81,74.87
N$110
  Bottom 0.254: 248.92,76.14 249.75,76.14
N$111
  Bottom 0.254: 236.28,76.95 235.7,76.36
N$112
  Bottom 0.254: 230.95,73.22 231.78,73.22
N$113
  Bottom 0.254: 228.61,74.11 229.2,73.52
N$114
  Top 0.254: 239.71,91.5 239.71,90.8 240.28,90.23 240.28,90.3 240.35,90.36 240.35,90.49 239.84,90.99
N$115
  Top 0.254: 234.31,92.27 233.49,92.27
N$116
  Top 0.254: 240.55,87.5 241.14,88.08
N$117
  Top 0.254: 229.17,88.22 228.59,88.8
N$118
  Top 0.254: 226.63,88.22 226.05,88.8
N$119
  Top 0.254: 236.6,80.71 236.92,80.71 237.11,80.9
N$120
  Top 0.254: 236.28,80.96 236.41,80.83 236.41,80.71
N$121
  Top 0.254: 260.92,83.36 261.5,82.78
N$122
  Top 0.254: 237.81,80.83 237.55,80.58 237.17,80.58 237.49,80.9 237.68,80.9 | 237.68,80.9 237.81,80.9 | 237.49,80.71 237.68,80.9
N$123
  Top 0.254: 242.27,80.64 242.85,81.23
N$124
  Top 0.254: 246.82,81.53 247.71,80.64
N$125
  Top 0.254: 247.21,89.85 246.89,89.53 247.08,89.53 247.14,89.6
N$126
  Top 0.254: 247.4,89.41 247.78,89.41 247.78,90.74 247.97,90.93
N$127
  Top 0.254: 247.59,89.28 247.59,89.03 247.52,88.96
N$128
  Top 0.254: 263.59,82.34 264.17,81.76
N$129
  Top 0.254: 270,85.03 270.83,85.03
N$130
  Top 0.254: 230,72.72 229.41,73.31
N$131
  Top 0.254: 235.46,76.45 236.09,76.45 | 236.09,76.45 236.35,76.45 236.66,76.77 236.66,76.45 236.47,76.26 235.65,76.26 | 236.09,76.45 235.71,76.83 235.46,76.83 235.39,76.77 235.52,76.77 235.71,76.58 235.46,76.58 235.39,76.64
N$132
  Top 0.254: 239.08,86.11 239.08,85.6
N$133
  Top 0.254: 238.57,86.04 238.82,85.79
N$134
  Top 0.254: 242.19,75.82 242.19,74.93 241.87,74.61 241.87,74.99 242.06,75.18 242.06,74.99 242.12,74.93
N$135
  Top 0.254: 237.68,84.52 237.68,85.15
N$136
  Top 0.254: 237.55,84.45 238.12,85.03
N$137
  Top 0.254: 241.36,86.11 241.3,86.04 241.3,85.66
N$138
  Top 0.254: 240.79,86.11 240.98,85.91 240.98,85.66
N$139
  Top 0.254: 242.56,73.28 241.84,72.7
N$140
  Top 0.254: 250.19,75.69 250.06,75.82 249.56,75.82 249.68,75.69 249.75,75.69
N$141
  Top 0.254: 249.3,76.77 248.73,77.34 248.73,77.53
N$142
  Top 0.254: 232.85,73.22 232.03,73.22
N$143
  Top 0.254: 233.11,72.9 233.43,72.9 233.49,72.83
N$144
  Top 0.254: 238.95,96.97 238.7,96.71 239.71,95.69
N$145
  Top 0.254: 238.95,96.77 239.65,96.08
N$146
  Top 0.254: 239.59,96.58 239.59,96.71 239.27,97.03
N$147
  Top 0.254: 241.74,100.84 241.43,100.52 242.19,99.76 242.19,100.9 241.94,101.16 241.94,101.09 241.55,100.71 242.06,100.2 242.06,100.77 241.94,100.9
N$148
  Top 0.254: 239.84,91.19 240.6,91.19 240.92,90.87
N$149
  Top 0.254: 240.79,90.8 240.54,90.8 240.28,91.06 240.41,91.06 240.6,90.87
N$150
  Top 0.254: 236.66,93.09 236.66,93.54 236.09,94.11 235.39,94.11 234.7,93.41
N$151
  Top 0.254: 235.14,93.47 235.14,93.66 235.2,93.73 | 235.27,93.79 235.46,93.98 235.97,93.98 236.54,93.41 236.54,93.22 235.46,93.22 235.2,93.47 235.2,93.66 | 235.2,93.66 235.2,93.73 | 235.2,93.73 235.27,93.79 | 235.27,93.79 236.09,93.79 236.47,93.41 235.46,93.41 235.2,93.66 | 235.2,93.66 236.16,93.66 236.28,93.54
N$152
  Top 0.813: 225.87,65.34 223.01,65.34
N$153
  Top 0.254: 223.65,68.2 225.62,68.2 225.62,68.33 225.55,68.39 223.97,68.39
N$154
  Top 0.254: 223.71,67.75 225.81,67.75 225.81,67.5 223.84,67.5
N$155
  Top 0.254: 228.28,75.56 225.81,75.56 225.81,74.93 227.65,74.93 228.28,75.56 | 228.28,75.56 227.65,76.2 225.87,76.2
N$156
  Top 0.254: 227.97,75.31 226,75.31 226,75.18 226.06,75.12 227.65,75.12
N$157
  Top 0.254: 227.9,75.76 225.81,75.76 225.81,76.01 227.77,76.01
N$158
  Top 0.254: 221.36,54.55 221.36,52.07 222,52.07 222,53.91 221.36,54.55 | 221.36,54.55 220.73,53.91 220.73,52.13
N$159
  Top 0.254: 221.62,54.23 221.62,52.26 221.74,52.26 221.81,52.32 221.81,53.91
N$160
  Top 0.254: 221.17,54.17 221.17,52.07 220.92,52.07 220.92,54.04
N$161
  Top 0.254: 218.82,54.55 218.82,52.07 219.46,52.07 219.46,53.91 218.82,54.55 | 218.82,54.55 218.19,53.91 218.19,52.13
N$162
  Top 0.254: 219.07,54.23 219.07,52.26 219.2,52.26 219.26,52.32 219.26,53.91
N$163
  Top 0.254: 218.63,54.17 218.63,52.07 218.38,52.07 218.38,54.04
N$164
  Top 0.254: 216.28,54.61 216.28,52.13 216.92,52.13 216.92,53.97 216.28,54.61 | 216.28,54.61 215.65,53.97 215.65,52.2
N$165
  Top 0.254: 216.53,54.29 216.53,52.32 216.66,52.32 216.72,52.39 216.72,53.97
N$166
  Top 0.254: 216.09,54.23 216.09,52.13 215.84,52.13 215.84,54.1
N$167
  Top 0.254: 272.48,65.66 274.95,65.66 274.95,66.29 273.11,66.29 272.48,65.66 | 272.48,65.66 273.11,65.02 274.89,65.02
N$168
  Top 0.254: 272.8,65.91 274.76,65.91 274.76,66.04 274.7,66.1 273.11,66.1
N$169
  Top 0.254: 272.86,65.47 274.95,65.47 274.95,65.21 272.99,65.21
N$170
  Top 0.254: 272.48,63.12 274.95,63.12 274.95,63.75 273.11,63.75 272.48,63.12 | 272.48,63.12 273.11,62.48 274.89,62.48
N$171
  Top 0.254: 272.8,63.37 274.76,63.37 274.76,63.5 274.7,63.56 273.11,63.56
N$172
  Top 0.254: 272.86,62.93 274.95,62.93 274.95,62.67 272.99,62.67
N$173
  Top 0.254: 272.48,71.25 274.95,71.25 274.95,71.88 273.11,71.88 272.48,71.25 | 272.48,71.25 273.11,70.61 274.89,70.61
N$174
  Top 0.254: 272.8,71.5 274.76,71.5 274.76,71.63 274.7,71.69 273.11,71.69
N$175
  Top 0.254: 272.86,71.06 274.95,71.06 274.95,70.8 272.99,70.8
N$176
  Top 0.254: 272.48,73.79 274.95,73.79 274.95,74.42 273.11,74.42 272.48,73.79 | 272.48,73.79 273.11,73.15 274.89,73.15
N$177
  Top 0.254: 272.8,74.04 274.76,74.04 274.76,74.17 274.7,74.23 273.11,74.23
N$178
  Top 0.254: 272.86,73.6 274.95,73.6 274.95,73.34 272.99,73.34
N$179
  Top 0.254: 272.48,76.33 274.95,76.33 274.95,76.96 273.11,76.96 272.48,76.33 | 272.48,76.33 273.11,75.69 274.89,75.69
N$180
  Top 0.254: 272.8,76.58 274.76,76.58 274.76,76.71 274.7,76.77 273.11,76.77
N$181
  Top 0.254: 272.86,76.14 274.95,76.14 274.95,75.88 272.99,75.88
N$182
  Top 0.254: 272.48,78.87 274.95,78.87 274.95,79.5 273.11,79.5 272.48,78.87 | 272.48,78.87 273.11,78.23 274.89,78.23
N$183
  Top 0.254: 272.8,79.12 274.76,79.12 274.76,79.25 274.7,79.31 273.11,79.31
N$184
  Top 0.254: 272.86,78.68 274.95,78.68 274.95,78.42 272.99,78.42
N$185
  Top 0.254: 272.41,81.41 274.89,81.41 274.89,82.04 273.05,82.04 272.41,81.41 | 272.41,81.41 273.05,80.77 274.83,80.77
N$186
  Top 0.254: 272.73,81.66 274.7,81.66 274.7,81.79 274.64,81.85 273.05,81.85
N$187
  Top 0.254: 272.8,81.22 274.89,81.22 274.89,80.96 272.92,80.96
N$188
  Top 0.254: 272.41,83.95 274.89,83.95 274.89,84.58 273.05,84.58 272.41,83.95 | 272.41,83.95 273.05,83.31 274.83,83.31
N$189
  Top 0.254: 272.73,84.2 274.7,84.2 274.7,84.33 274.64,84.39 273.05,84.39
N$190
  Top 0.254: 272.8,83.76 274.89,83.76 274.89,83.5 272.92,83.5
N$191
  Top 0.254: 243.97,110.3 243.97,112.78 243.33,112.78 243.33,110.94 243.97,110.3 | 243.97,110.3 244.6,110.94 244.6,112.71
N$192
  Top 0.254: 243.71,110.62 243.71,112.58 243.59,112.58 243.52,112.52 243.52,110.94
N$193
  Top 0.254: 244.16,110.68 244.16,112.78 244.41,112.78 244.41,110.81
N$194
  Top 0.254: 241.68,110.36 241.68,112.84 241.05,112.84 241.05,111 241.68,110.36 | 241.68,110.36 242.32,111 242.32,112.78
N$195
  Top 0.254: 241.43,110.68 241.43,112.65 241.3,112.65 241.24,112.58 241.24,111
N$196
  Top 0.254: 241.87,110.74 241.87,112.84 242.12,112.84 242.12,110.87
N$197
  Top 0.254: 239.39,110.3 239.39,112.78 238.76,112.78 238.76,110.94 239.39,110.3 | 239.39,110.3 240.03,110.94 240.03,112.71
N$198
  Top 0.254: 239.14,110.62 239.14,112.58 239.01,112.58 238.95,112.52 238.95,110.94
N$199
  Top 0.254: 239.59,110.68 239.59,112.78 239.84,112.78 239.84,110.81
N$200
  Top 0.254: 226.69,111.57 226.69,114.05 226.06,114.05 226.06,112.2 226.69,111.57 | 226.69,111.57 227.33,112.2 227.33,113.98
N$201
  Top 0.254: 226.44,111.89 226.44,113.86 226.31,113.86 226.25,113.79 226.25,112.2
N$202
  Top 0.254: 226.89,111.95 226.89,114.05 227.14,114.05 227.14,112.08
N$203
  Top 0.254: 234.06,52.07 234.57,52.58 233.74,53.4 232.73,53.4
N$204
  Top 0.254: 227.46,111.25 227.01,111.7 227.08,111.7 227.2,111.82
N$205
  Top 0.254: 213.74,112.08 213.74,114.05 213.61,114.05 213.55,113.98 213.55,112.39
N$206
  Top 0.254: 214.19,112.14 214.19,114.24 214.44,114.24 214.44,112.27
N$207
  Top 0.254: 214.82,111.12 214.44,111.51 214.44,111.89 | 214.44,111.89 214.5,111.95 | 214.44,111.89 214.19,111.63
N$208
  Top 0.254: 233.11,52.96 233.11,52.01 233.62,51.5
N$209
  Top 0.254: 209.23,116.46 207.26,116.46 207.26,116.33 207.33,116.27 208.91,116.27
N$210
  Top 0.254: 209.17,116.9 207.07,116.9 207.07,117.16 209.04,117.16
N$211
  Top 0.254: 209.87,116.02 209.87,116.14 209.49,116.52 209.49,116.27 209.93,115.82 209.8,115.82 209.36,116.27 209.23,116.27
N$212
  Top 0.254: 233.81,51.75 233.81,52.13 233.3,52.64 233.3,51.94 233.68,51.56 233.68,51.94 233.36,52.26
N$213
  Top 0.254: 204.03,116.46 202.06,116.46 202.06,116.33 202.12,116.27 203.71,116.27
N$214
  Top 0.254: 203.96,116.9 201.87,116.9 201.87,117.16 203.84,117.16
N$215
  Top 0.254: 204.79,115.95 204.79,116.02 204.34,116.46 204.09,116.2 204.41,116.2
N$216
  Top 0.254: 233.11,53.34 233.49,53.34 234.25,52.58 234.25,52.52 234.12,52.39 234.06,52.39 233.24,53.21 233.36,53.21 234.12,52.45
N$217
  Top 0.254: 204.28,103.63 202.31,103.63 202.31,103.5 202.37,103.44 203.96,103.44
N$218
  Top 0.254: 204.22,104.08 202.12,104.08 202.12,104.33 204.09,104.33
N$219
  Top 0.254: 236.6,52.07 237.11,52.58 236.28,53.4 235.27,53.4
N$220
  Top 0.254: 271.97,113.16 271.97,115.13 271.84,115.13 271.78,115.06 271.78,113.47
N$221
  Top 0.254: 272.41,113.22 272.41,115.32 272.67,115.32 272.67,113.35
N$222
  Top 0.254: 209.55,101.35 207.07,101.35 207.07,100.71 208.91,100.71 209.55,101.35 | 209.55,101.35 208.91,101.98 207.14,101.98
N$223
  Top 0.254: 209.23,101.09 207.26,101.09 207.26,100.97 207.33,100.9 208.91,100.9
N$224
  Top 0.254: 209.17,101.54 207.07,101.54 207.07,101.79 209.04,101.79
N$225
  Top 0.254: 209.61,103.89 207.14,103.89 207.14,103.25 208.98,103.25 209.61,103.89 | 209.61,103.89 208.98,104.52 207.2,104.52
N$226
  Top 0.254: 209.3,103.63 207.33,103.63 207.33,103.5 207.39,103.44 208.98,103.44
N$227
  Top 0.254: 209.23,104.08 207.14,104.08 207.14,104.33 209.11,104.33
N$228
  Top 0.254: 235.65,52.96 235.65,52.01 236.16,51.5
N$229
  Top 0.254: 204.03,113.09 204.03,113.28 203.33,113.98 201.93,113.98 201.93,113.79 201.99,113.73 203.33,113.73 203.84,113.22 203.84,114.24 203.45,114.62 201.99,114.62 201.99,114.43 203.39,114.43 203.71,114.11
N$230
  Top 0.254: 214.19,119.06 214.19,117.41
N$231
  Top 0.254: 214.63,116.71 214,116.71 213.68,117.03 213.68,119 213.55,119.13 213.55,117.41 214.12,116.84 214,116.84 213.55,117.28 214,117.28 | 214,117.28 214.38,116.9 | 214,117.28 213.8,117.47 213.8,119.06
N$232
  Top 0.254: 216.85,119.19 216.85,118.11 217.55,117.41 216.41,117.41 216.15,117.66 216.15,119.06 216.09,119.13 216.28,119.13 216.28,117.73 216.53,117.47
N$233
  Top 0.254: 217.23,117.54 217.11,117.54 216.72,117.92 216.72,119.06 216.98,119.06 216.98,118.11
N$234
  Top 0.254: 216.85,113.98 216.85,112.33 217.36,111.82 216.66,111.82 216.22,112.27 | 216.22,112.27 216.22,113.86 216.15,113.92 216.15,112.33 216.22,112.27 | 216.22,112.27 216.6,112.27 216.85,112.01 216.98,112.14 216.98,113.98 216.66,113.98 216.72,113.92 216.72,111.95 216.41,112.27 216.41,113.86
N$235
  Top 0.254: 229.55,119.13 229.49,119.19 228.73,119.19 228.85,119.06 228.85,117.28
N$236
  Top 0.254: 229.43,119.06 229.43,119
N$237
  Top 0.254: 226.95,119.06 226.95,117.28 227.14,117.09 227.14,119 227.08,119.06
N$238
  Top 0.254: 226.19,117.09 226.19,116.97 226.69,116.46
N$239
  Top 0.254: 226.95,116.52 226.95,116.65 226.31,117.28
N$240
  Top 0.254: 271.59,112.58 271.65,112.58 271.78,112.71 271.78,113.09 271.84,113.16 271.84,112.97 271.97,112.84 271.72,112.84 271.59,112.71
N$241
  Bottom 0.254: 251.71,107.7 251.71,107.44 | 251.71,106.81 251.71,107.44 | 251.71,107.44 251.84,107.57 251.84,107.31 | 251.84,106.93 251.84,107.31 | 251.84,107.31 251.97,107.44 251.97,107.19 252.09,107.06 252.09,107.31
N$242
  Top 0.254: 274.89,114.68 275.46,114.68 275.46,113.66 273.56,111.76
N$243
  Top 0.254: 275.21,114.24 275.21,113.6 275.08,113.47 275.08,114.05 275.02,114.11 275.02,113.54 274.26,112.78 274.26,113.98 274.32,114.05 274.32,113.35 274.45,113.22 274.45,114.05 274.51,114.11 274.51,113.54 274.7,113.35 274.7,114.11
N$244
  Top 0.254: 277.11,83.69 277.05,83.76 277.05,84.27 277.24,84.07 277.24,83.82 277.62,84.2 277.62,84.39 276.99,85.03 276.61,85.03 277.31,84.33 277.43,84.33 276.86,84.9 276.86,84.96
N$245
  Top 0.254: 277.11,81.15 277.05,81.22 277.05,81.72 277.24,81.53 277.24,81.28 277.62,81.66 277.62,81.85 276.99,82.49 276.61,82.49 277.31,81.79 277.43,81.79 276.86,82.36 276.86,82.42
N$246